# EAGLE schematic Body_Scale_v01 (EAGLE 6.5.0)
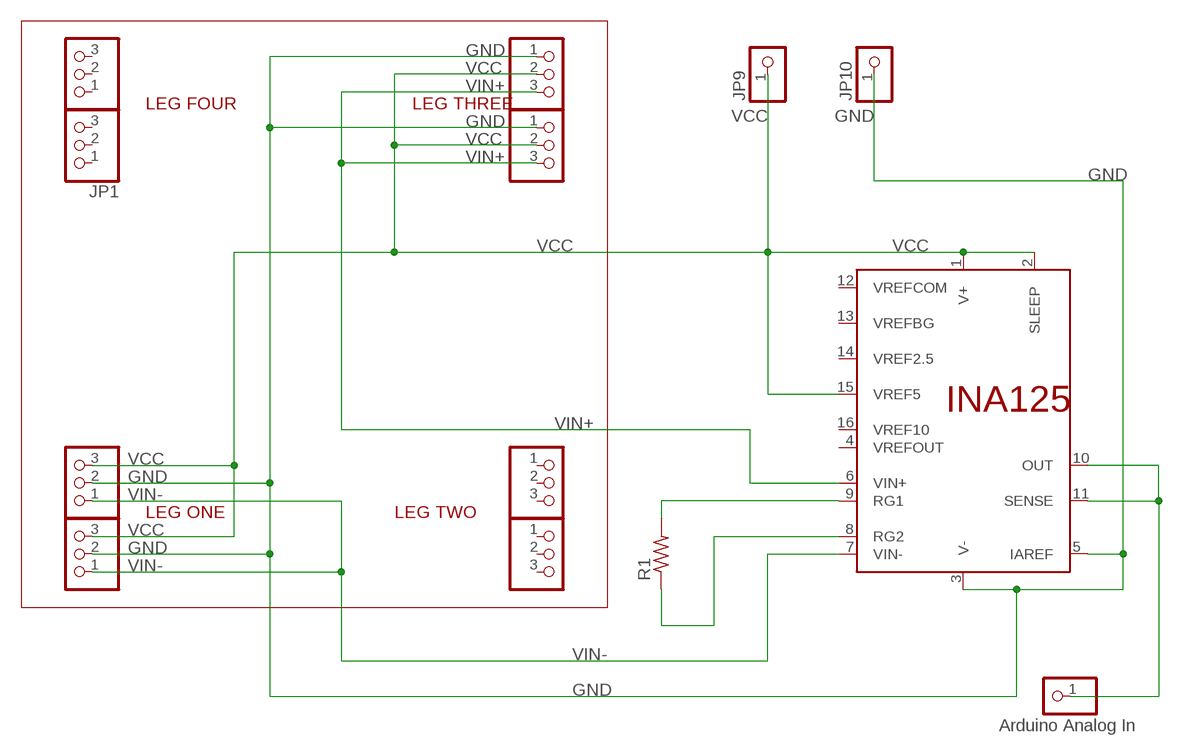
[diagram p0: schematic, sheet 1]

## Parts
IC1  INA125  [DIL16]
JP1  PINHD-1X3  [1X03]
JP2  PINHD-1X3  [1X03]
JP3  PINHD-1X3  [1X03]
JP4  PINHD-1X3  [1X03]
JP5  PINHD-1X3  [1X03]
JP6  PINHD-1X3  [1X03]
JP7  PINHD-1X3  [1X03]
JP8  PINHD-1X3  [1X03]
JP9  PINHD-1X1  [1X01]
JP10  PINHD-1X1  [1X01]
JP11  PINHD-1X1  [1X01]
R1  R-US_R0805  [R0805]

## Nets
GND: IC1.3(V-) IC1.5(IAREF) JP3.1 JP4.1 JP5.2 JP6.2 JP10.1
N$1: IC1.9(RG1) R1.2
N$2: IC1.8(RG2) R1.1
N$3: IC1.10(OUT) IC1.11(SENSE) JP11.1
VCC: IC1.1(V+) IC1.2(SLEEP) IC1.15(VREF5) JP3.2 JP4.2 JP5.3 JP6.3 JP9.1
VIN+: IC1.6(VIN+) JP3.3 JP4.3
VIN-: IC1.7(VIN-) JP5.1 JP6.1
Unconnected: IC1.4(VREFOUT) IC1.12(VREFCOM) IC1.13(VREFBG) IC1.14(VREF2.5) IC1.16(VREF10) JP1.1 JP1.2 JP1.3 JP2.1 JP2.2 JP2.3 JP7.1 JP7.2 JP7.3 JP8.1 JP8.2 JP8.3

## Notes on the sheet
- LEG FOUR | LEG THREE
- LEG ONE | LEG TWO
- Arduino Analog In

## Library data of the parts
IC1 = AlexW-Eagle-Libraries:INA125: INA125 Texas Instruments/Burr Brown INA 125 Instrumentation Amplifier
JP1-JP8 = adafruit:PINHD-1X3: PIN HEADER
JP9-JP11 = adafruit:PINHD-1X1: Pin header 1x1 for 0.1" spacing With round pins
R1 = resistor:R-US_: RESISTOR, American symbol